# Altium schematic sheet WunderBar_v102b.SchDoc
size A2
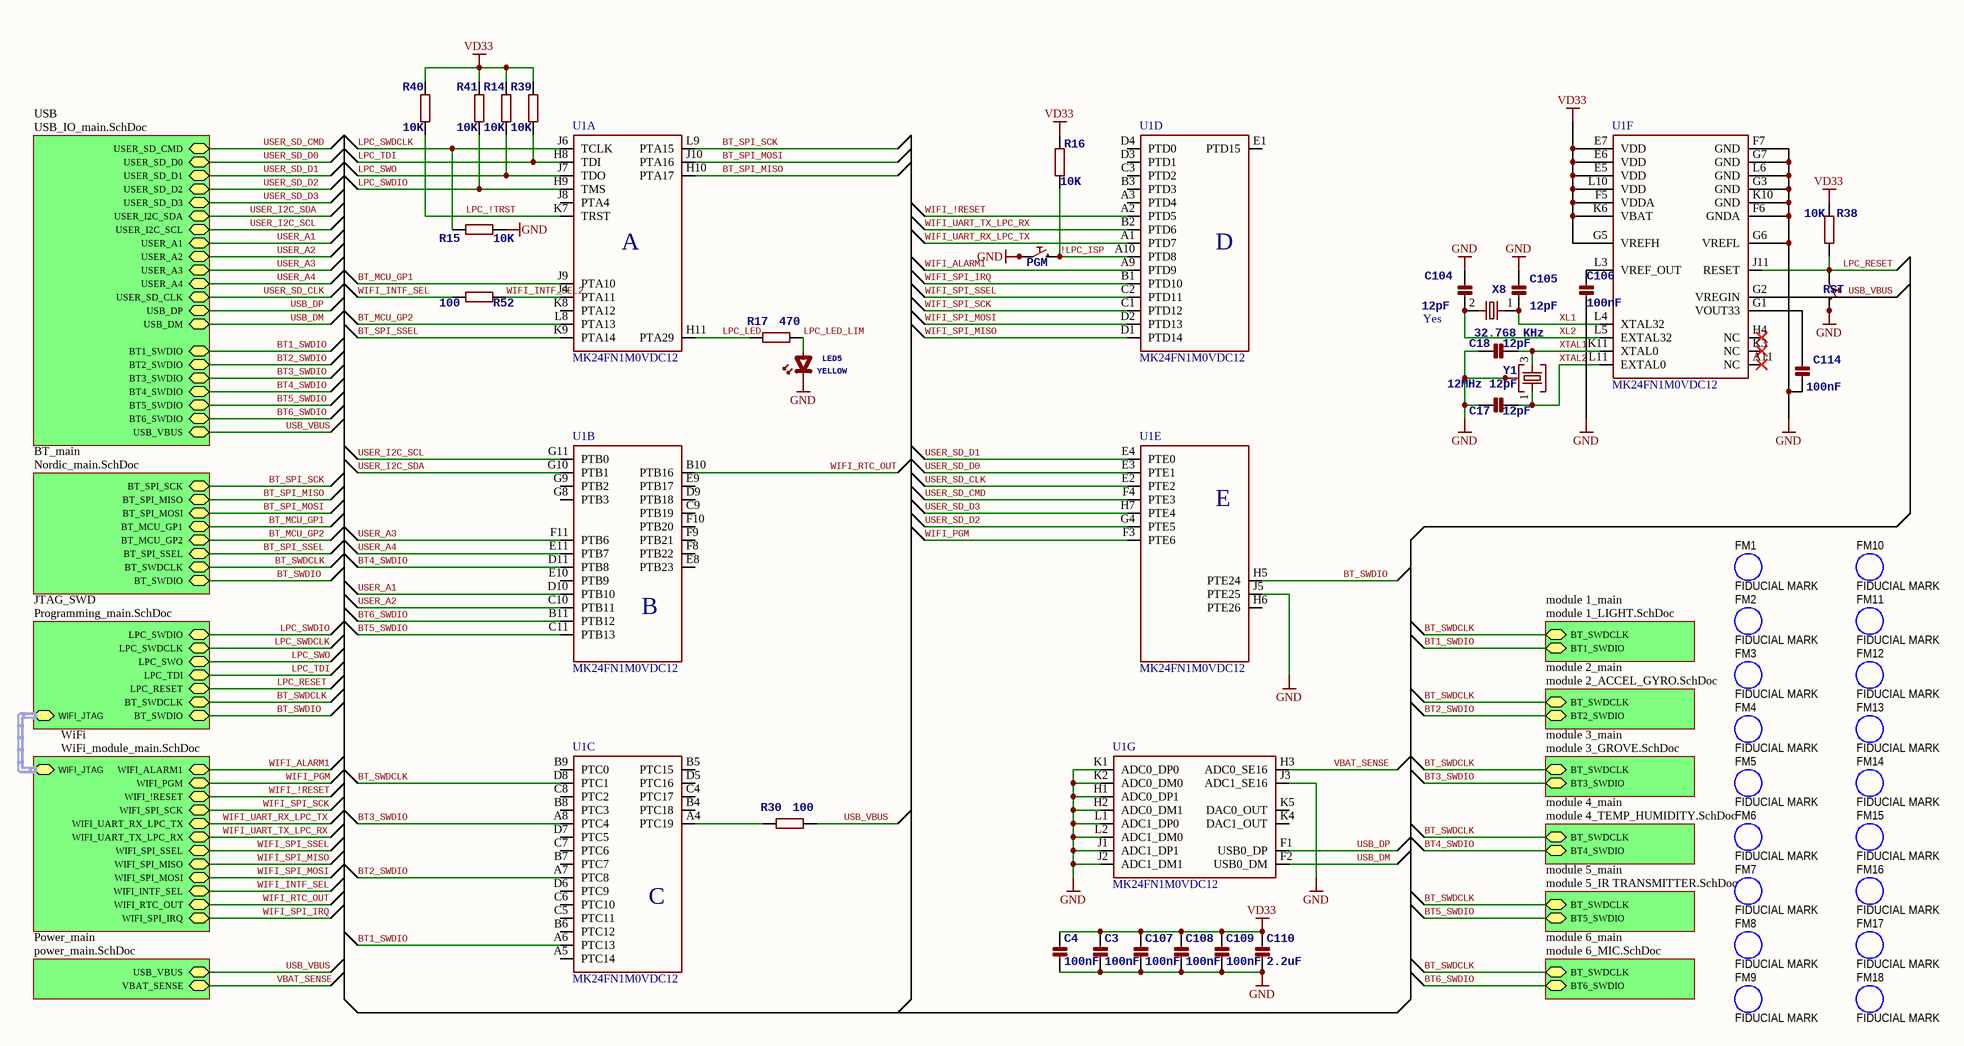
[diagram p0: WunderBar_v102b.SchDoc]

## Parts
C3  100nF  [0402]
C4  100nF  [0402]
C17  12pF  [0402]
C18  12pF  [0402]
C104  12pF  SMD: Yes  [0402]
C105  12pF  [0402]
C106  100nF  [0402]
C107  100nF  [0402]
C108  100nF  [0402]
C109  100nF  [0402]
C110  2.2uF  [0603]
C114  100nF  [0402]
FM1  FIDUCIAL MARK  [FIDUCIAL MARK 0.6MM]  (no BOM)
FM2  FIDUCIAL MARK  [FIDUCIAL MARK 0.6MM]  (no BOM)
FM3  FIDUCIAL MARK  [FIDUCIAL MARK 0.6MM]  (no BOM)
FM4  FIDUCIAL MARK  [FIDUCIAL MARK 0.6MM]  (no BOM)
FM5  FIDUCIAL MARK  [FIDUCIAL MARK 0.6MM]  (no BOM)
FM6  FIDUCIAL MARK  [FIDUCIAL MARK 0.6MM]  (no BOM)
FM7  FIDUCIAL MARK  [FIDUCIAL MARK 0.6MM]  (no BOM)
FM8  FIDUCIAL MARK  [FIDUCIAL MARK 0.6MM]  (no BOM)
FM9  FIDUCIAL MARK  [FIDUCIAL MARK 0.6MM]  (no BOM)
FM10  FIDUCIAL MARK  [FIDUCIAL MARK 0.6MM]  (no BOM)
FM11  FIDUCIAL MARK  [FIDUCIAL MARK 0.6MM]  (no BOM)
FM12  FIDUCIAL MARK  [FIDUCIAL MARK 0.6MM]  (no BOM)
FM13  FIDUCIAL MARK  [FIDUCIAL MARK 0.6MM]  (no BOM)
FM14  FIDUCIAL MARK  [FIDUCIAL MARK 0.6MM]  (no BOM)
FM15  FIDUCIAL MARK  [FIDUCIAL MARK 0.6MM]  (no BOM)
FM16  FIDUCIAL MARK  [FIDUCIAL MARK 0.6MM]  (no BOM)
FM17  FIDUCIAL MARK  [FIDUCIAL MARK 0.6MM]  (no BOM)
FM18  FIDUCIAL MARK  [FIDUCIAL MARK 0.6MM]  (no BOM)
LED5  YELLOW  [0402_POLAR]
PGM  Tact Sw 4.6x2.8  [CK-KMR2]  (value not drawn)
R14  10K  [0402]
R15  10K  [0402]
R16  10K  [0402]
R17  470  [0402]
R30  100  [0402]
R38  10K  [0402]
R39  10K  [0402]
R40  10K  [0402]
R41  10K  [0402]
R52  100  [0402]
RST  Tact Sw 4.6x2.8  [CK-KMR2]  (value not drawn)
U1  MK24FN1M0VDC12  [BGA121-0.65]  (parts A,B,C,D,E,F,G of 7)
X8  32.768 KHz  [1206_MINIMELF_COMBO]
Y1  12MHz 12pF  [ABM8G]

## Sub-sheets
BT_main = Nordic_main.SchDoc: BT_SPI_SCK, BT_SPI_MISO, BT_SPI_MOSI, BT_MCU_GP1, BT_MCU_GP2, BT_SPI_SSEL, BT_SWDCLK, BT_SWDIO
JTAG_SWD = Programming_main.SchDoc: LPC_SWDIO, LPC_SWDCLK, LPC_SWO, LPC_TDI, LPC_RESET, WIFI_JTAG (harness WIFI_JTAG), BT_SWDCLK, BT_SWDIO
module 1_main = module 1_LIGHT.SchDoc: BT_SWDCLK, BT1_SWDIO
module 2_main = module 2_ACCEL_GYRO.SchDoc: BT_SWDCLK, BT2_SWDIO
module 3_main = module 3_GROVE.SchDoc: BT_SWDCLK, BT3_SWDIO
module 4_main = module 4_TEMP_HUMIDITY.SchDoc: BT_SWDCLK, BT4_SWDIO
module 5_main = module 5_IR TRANSMITTER.SchDoc: BT_SWDCLK, BT5_SWDIO
module 6_main = module 6_MIC.SchDoc: BT_SWDCLK, BT6_SWDIO
Power_main = power_main.SchDoc: USB_VBUS, VBAT_SENSE
USB = USB_IO_main.SchDoc: USER_SD_CMD, USER_SD_D0, USER_SD_D1, USER_SD_D2, USER_SD_D3, USER_I2C_SDA, USER_I2C_SCL, USER_A1, USER_A2, USER_A3, USER_A4, USER_SD_CLK, USB_DP, USB_DM, BT1_SWDIO, BT2_SWDIO, BT3_SWDIO, BT4_SWDIO, BT5_SWDIO, BT6_SWDIO, USB_VBUS
WiFi = WiFi_module_main.SchDoc: WIFI_ALARM1, WIFI_PGM, WIFI_!RESET, WIFI_SPI_SCK, WIFI_UART_RX_LPC_TX, WIFI_UART_TX_LPC_RX, WIFI_SPI_SSEL, WIFI_SPI_MISO, WIFI_SPI_MOSI, WIFI_INTF_SEL, WIFI_RTC_OUT, WIFI_SPI_IRQ, WIFI_JTAG (harness WIFI_JTAG)

## Nets
GND: C3.2 C4.2 C17.2 C18.2 C104.2 C105.2 C106.2 C107.2 C108.2 C109.2 C110.2 C114.1 LED5.K(CATHODE) PGM.P1 PGM.P2 R15.2 RST.P3 RST.P4 U1.F6(GNDA) U1.F7(GND) U1.G3(GND) U1.G6(VREFL) U1.G7(GND) U1.H1(ADC0_DP1) U1.H2(ADC0_DM1) U1.J1(ADC1_DP1) U1.J2(ADC1_DM1) U1.J3(ADC1_SE16) U1.J5(PTE25) U1.K1(ADC0_DP0) U1.K2(ADC0_DM0) U1.K10(GND) U1.L1(ADC1_DP0) U1.L2(ADC1_DM0) U1.L6(GND) Y1.2(GND) Y1.4(GND)
VD33: C3.1 C4.1 C107.1 C108.1 C109.1 C110.1 R14.2 R16.2 R38.2 R39.2 R40.2 R41.2 U1.E5(VDD) U1.E6(VDD) U1.E7(VDD) U1.F5(VDDA) U1.G5(VREFH) U1.K6(VBAT) U1.L10(VDD)
!LPC_ISP: PGM.P3 PGM.P4 R16.1 U1.A10(PTD8)
BT1_SWDIO: U1.A6(PTC13) ; sheet USB/BT1_SWDIO, sheet module 1_main/BT1_SWDIO
BT2_SWDIO: U1.A7(PTC8) ; sheet USB/BT2_SWDIO, sheet module 2_main/BT2_SWDIO
BT3_SWDIO: U1.A8(PTC4) ; sheet USB/BT3_SWDIO, sheet module 3_main/BT3_SWDIO
BT4_SWDIO: U1.D11(PTB8) ; sheet USB/BT4_SWDIO, sheet module 4_main/BT4_SWDIO
BT5_SWDIO: U1.C11(PTB13) ; sheet USB/BT5_SWDIO, sheet module 5_main/BT5_SWDIO
BT6_SWDIO: U1.B11(PTB12) ; sheet USB/BT6_SWDIO, sheet module 6_main/BT6_SWDIO
BT_MCU_GP1: U1.J9(PTA10) ; sheet BT_main/BT_MCU_GP1
BT_MCU_GP2: U1.L8(PTA13) ; sheet BT_main/BT_MCU_GP2
BT_SPI_MISO: U1.H10(PTA17) ; sheet BT_main/BT_SPI_MISO
BT_SPI_MOSI: U1.J10(PTA16) ; sheet BT_main/BT_SPI_MOSI
BT_SPI_SCK: U1.L9(PTA15) ; sheet BT_main/BT_SPI_SCK
BT_SPI_SSEL: U1.K9(PTA14) ; sheet BT_main/BT_SPI_SSEL
BT_SWDCLK: U1.D8(PTC1) ; sheet BT_main/BT_SWDCLK, sheet JTAG_SWD/BT_SWDCLK, sheet module 1_main/BT_SWDCLK, sheet module 2_main/BT_SWDCLK, sheet module 3_main/BT_SWDCLK, sheet module 4_main/BT_SWDCLK, sheet module 5_main/BT_SWDCLK, sheet module 6_main/BT_SWDCLK
BT_SWDIO: U1.H5(PTE24) ; sheet BT_main/BT_SWDIO, sheet JTAG_SWD/BT_SWDIO
LPC_!TRST: R40.1 U1.K7(TRST)
LPC_LED: R17.2 U1.H11(PTA29)
LPC_LED_LIM: LED5.A(ANODE) R17.1
LPC_RESET: R38.1 RST.P1 RST.P2 U1.J11(RESET) ; sheet JTAG_SWD/LPC_RESET
LPC_SWDCLK: R15.1 U1.J6(TCLK) ; sheet JTAG_SWD/LPC_SWDCLK
LPC_SWDIO: R41.1 U1.H9(TMS) ; sheet JTAG_SWD/LPC_SWDIO
LPC_SWO: R14.1 U1.J7(TDO) ; sheet JTAG_SWD/LPC_SWO
LPC_TDI: R39.1 U1.H8(TDI) ; sheet JTAG_SWD/LPC_TDI
USB_DM: U1.F2(USB0_DM) ; sheet USB/USB_DM
USB_DP: U1.F1(USB0_DP) ; sheet USB/USB_DP
USB_VBUS: R30.1 U1.G2(VREGIN) ; sheet USB/USB_VBUS, sheet Power_main/USB_VBUS
USER_A1: U1.D10(PTB10) ; sheet USB/USER_A1
USER_A2: U1.C10(PTB11) ; sheet USB/USER_A2
USER_A3: U1.F11(PTB6) ; sheet USB/USER_A3
USER_A4: U1.E11(PTB7) ; sheet USB/USER_A4
USER_I2C_SCL: U1.G11(PTB0) ; sheet USB/USER_I2C_SCL
USER_I2C_SDA: U1.G10(PTB1) ; sheet USB/USER_I2C_SDA
USER_SD_CLK: U1.E2(PTE2) ; sheet USB/USER_SD_CLK
USER_SD_CMD: U1.F4(PTE3) ; sheet USB/USER_SD_CMD
USER_SD_D0: U1.E3(PTE1) ; sheet USB/USER_SD_D0
USER_SD_D1: U1.E4(PTE0) ; sheet USB/USER_SD_D1
USER_SD_D2: U1.G4(PTE5) ; sheet USB/USER_SD_D2
USER_SD_D3: U1.H7(PTE4) ; sheet USB/USER_SD_D3
VBAT_SENSE: U1.H3(ADC0_SE16) ; sheet Power_main/VBAT_SENSE
WIFI_!RESET: U1.A2(PTD5) ; sheet WiFi/WIFI_!RESET
WIFI_ALARM1: U1.A9(PTD9) ; sheet WiFi/WIFI_ALARM1
WIFI_INTF_SEL: R52.1 ; sheet WiFi/WIFI_INTF_SEL
WIFI_INTF_SEL2: R52.2 U1.J4(PTA11)
WIFI_PGM: U1.F3(PTE6) ; sheet WiFi/WIFI_PGM
WIFI_RTC_OUT: U1.B10(PTB16) ; sheet WiFi/WIFI_RTC_OUT
WIFI_SPI_IRQ: U1.B1(PTD10) ; sheet WiFi/WIFI_SPI_IRQ
WIFI_SPI_MISO: U1.D1(PTD14) ; sheet WiFi/WIFI_SPI_MISO
WIFI_SPI_MOSI: U1.D2(PTD13) ; sheet WiFi/WIFI_SPI_MOSI
WIFI_SPI_SCK: U1.C1(PTD12) ; sheet WiFi/WIFI_SPI_SCK
WIFI_SPI_SSEL: U1.C2(PTD11) ; sheet WiFi/WIFI_SPI_SSEL
WIFI_UART_RX_LPC_TX: U1.A1(PTD7) ; sheet WiFi/WIFI_UART_RX_LPC_TX
WIFI_UART_TX_LPC_RX: U1.B2(PTD6) ; sheet WiFi/WIFI_UART_TX_LPC_RX
XL1: C105.1 U1.L4(XTAL32) X8.1
XL2: C104.1 U1.L5(EXTAL32) X8.2
XTAL1: C18.1 U1.K11(XTAL0) Y1.3
XTAL2: C17.1 U1.L11(EXTAL0) Y1.1
NetC106_1: C106.1 U1.L3(VREF_OUT)
NetC114_2: C114.2 U1.G1(VOUT33)
NetR30_2: R30.2 U1.A4(PTC19)

Not connected (* = marked no-connect by the designer): U1 A3(PTD4) A5(PTC14) A11(NC)* B3(PTD3) B4(PTC18) B5(PTC15) B6(PTC12) B7(PTC7) B8(PTC3) B9(PTC0) C3(PTD2) C4(PTC17) C5(PTC11) C6(PTC10) C7(PTC6) C8(PTC2) C9(PTB19) D3(PTD1) D4(PTD0) D5(PTC16) D6(PTC9) D7(PTC5) D9(PTB18) E1(PTD15) E8(PTB23) E9(PTB17) E10(PTB9) F8(PTB22) F9(PTB21) F10(PTB20) G8(PTB3) G9(PTB2) H4(NC)* H6(PTE26) J8(PTA4) K3(NC)* K4(DAC1_OUT) K5(DAC0_OUT) K8(PTA12)

## Buses and harness runs
harness sheet JTAG_SWD/WIFI_JTAG = sheet WiFi/WIFI_JTAG

## Notes on the sheet
- (in symbol MK24FN1M0VDC12, part A) A
- (in symbol MK24FN1M0VDC12, part B) B
- (in symbol MK24FN1M0VDC12, part C) C
- (in symbol MK24FN1M0VDC12, part D) D
- (in symbol MK24FN1M0VDC12, part E) E

## Library data of the parts
C3 C4 C17 C18 C104-C110 C114 = CAP_CERAMIC0402: Ceramic capacitor
  C3 C4 C17 C18 C105-C110 C114: SMD: Yes
LED5 = LED0402: LED common; SMD: Yes
PGM RST = PUSHBUTTONKMR2XX: Push button; SMD: Yes
R14-R17 R30 R38-R41 R52 = R-EU_0402: RESISTOR; SMD: Yes
U1 = MK24FN1M0VDC12: MK24FN1M0VDC12 121-PIN BGA Microcontroller; SMD: Yes
X8 = CRYSTAL1206: CL05C120JB5; 1: 1; 2: 2; SMD: Yes
Y1 = CRYSTAL_WITH_GROUNDABM8G: CX2520DB16000D0GEJCC; 1: 1; 2: 2; SMD: Yes
FM1-FM18 = FIDUCIAL MARK: SMD: Fiducial